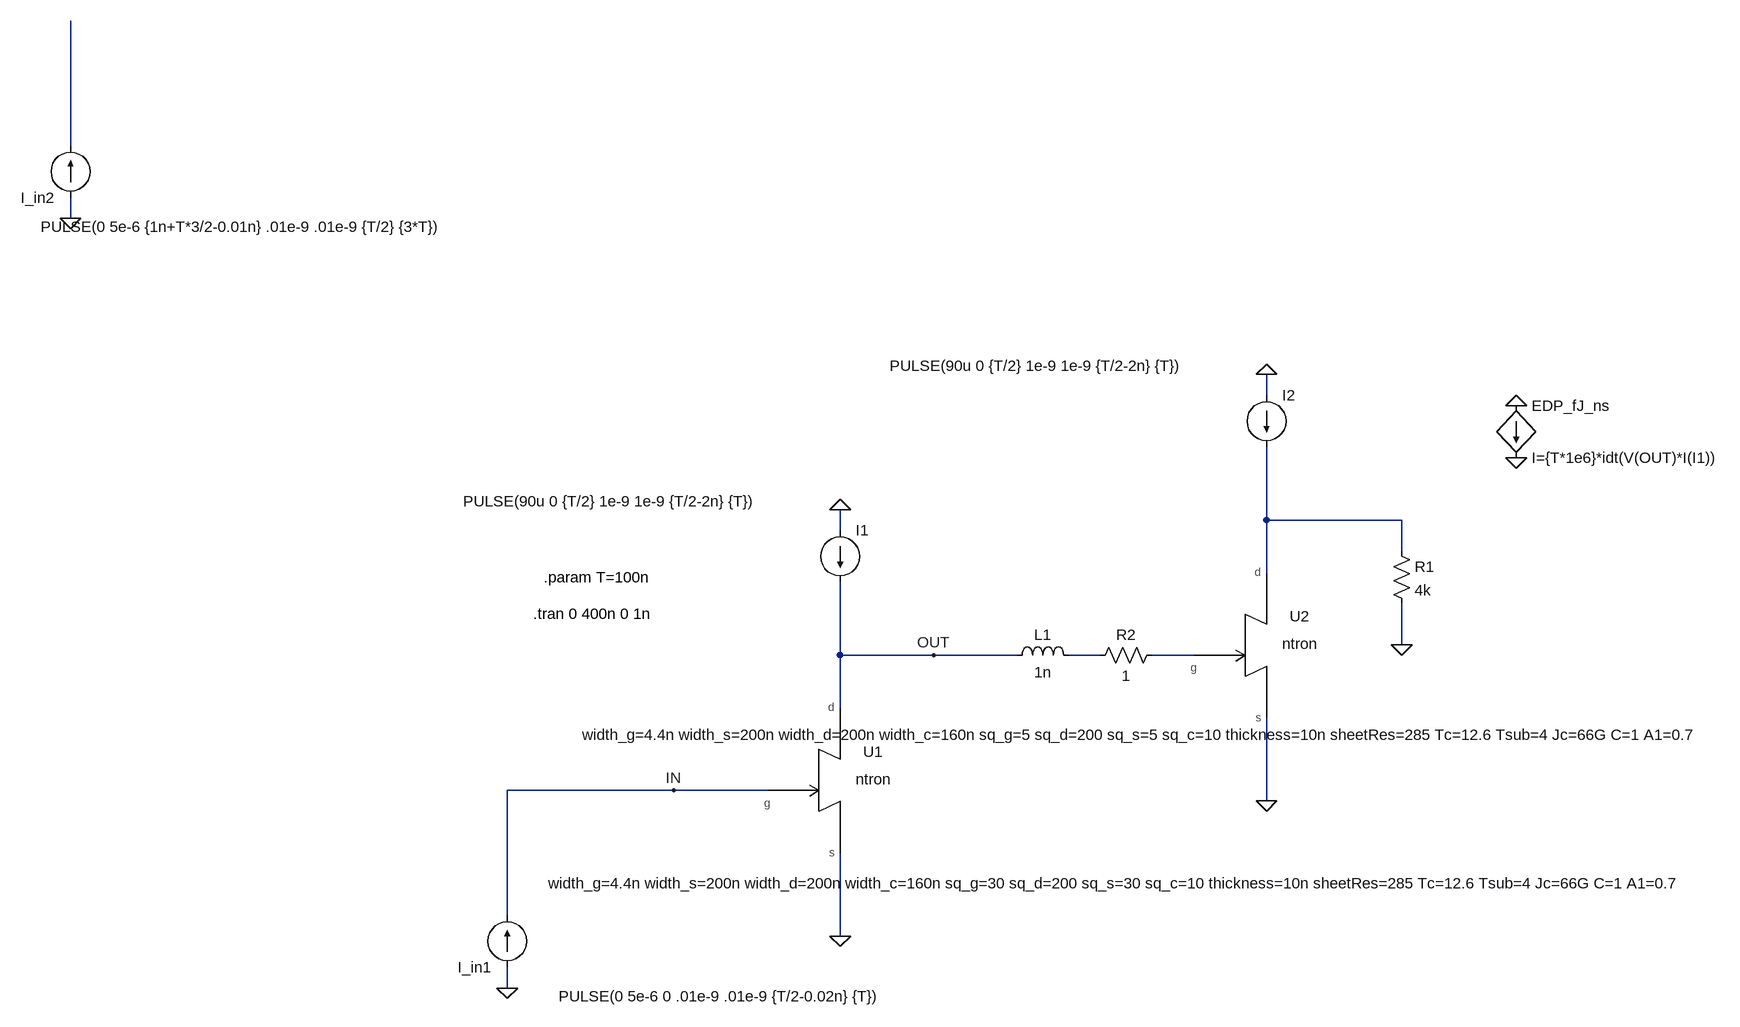
[diagram p0: schematic 2_ntron_EDP_test_latching.asc]
2_ntron_EDP_test_latching.asc, the LTspice schematic file:
Version 4
SHEET 1 1748 784
WIRE -1104 -672 -1104 -864
WIRE -1104 -560 -1104 -592
WIRE 736 -288 736 -320
WIRE 736 -96 736 -208
WIRE 944 -96 736 -96
WIRE 80 -80 80 -112
WIRE 944 -48 944 -96
WIRE 736 -16 736 -96
WIRE 944 96 944 32
WIRE 80 112 80 0
WIRE 224 112 80 112
WIRE 352 112 224 112
WIRE 480 112 432 112
WIRE 624 112 560 112
WIRE 80 192 80 112
WIRE -176 320 -432 320
WIRE -32 320 -176 320
WIRE 736 336 736 208
WIRE -432 512 -432 320
WIRE 80 544 80 416
WIRE -432 624 -432 592
FLAG 80 544 0
FLAG -432 624 0
FLAG 80 -112 0
FLAG 1120 -192 0
FLAG 1120 -272 0
FLAG -176 320 IN
FLAG 224 112 OUT
FLAG -1104 -560 0
FLAG 736 336 0
FLAG 944 96 0
FLAG 736 -320 0
SYMBOL current -432 592 R180
WINDOW 3 -580 -45 Left 2
WINDOW 123 0 0 Left 2
WINDOW 39 0 0 Left 2
SYMATTR Value PULSE(0 5e-6 0 .01e-9 .01e-9 {T/2-0.02n} {T})
SYMATTR InstName I_in1
SYMBOL bi 1120 -272 R0
SYMATTR InstName EDP_fJ_ns
SYMATTR Value I={T*1e6}*idt(V(OUT)*I(I1))
SYMBOL current -1104 -592 R180
WINDOW 3 -580 -45 Left 2
WINDOW 123 0 0 Left 2
WINDOW 39 0 0 Left 2
SYMATTR Value PULSE(0 5e-6 {1n+T*3/2-0.01n} .01e-9 .01e-9 {T/2} {3*T})
SYMATTR InstName I_in2
SYMBOL ntron 80 304 R0
WINDOW 39 433 143 Top 2
SYMATTR SpiceLine width_g=4.4n width_s=200n width_d=200n width_c=160n sq_g=30 sq_d=200 sq_s=30 sq_c=10 thickness=10n sheetRes=285 Tc=12.6 Tsub=4 Jc=66G C=1 A1=0.7
SYMATTR InstName U1
SYMBOL res 928 -64 R0
SYMATTR InstName R1
SYMATTR Value 4k
SYMBOL ntron 736 96 R0
WINDOW 39 -184 123 Top 2
SYMATTR SpiceLine width_g=4.4n width_s=200n width_d=200n width_c=160n sq_g=5 sq_d=200 sq_s=5 sq_c=10 thickness=10n sheetRes=285 Tc=12.6 Tsub=4 Jc=66G C=1 A1=0.7
SYMATTR InstName U2
SYMBOL ind 336 128 R270
WINDOW 0 32 56 VTop 2
WINDOW 3 5 56 VBottom 2
SYMATTR InstName L1
SYMATTR Value 1n
SYMBOL res 576 96 R90
WINDOW 0 0 56 VBottom 2
WINDOW 3 32 56 VTop 2
SYMATTR InstName R2
SYMATTR Value 1
SYMBOL current 80 -80 R0
WINDOW 3 -580 -45 Left 2
WINDOW 123 0 0 Left 2
WINDOW 39 0 0 Left 2
SYMATTR Value PULSE(90u 0 {T/2} 1e-9 1e-9 {T/2-2n} {T})
SYMATTR InstName I1
SYMBOL current 736 -288 R0
WINDOW 3 -580 -45 Left 2
WINDOW 123 0 0 Left 2
WINDOW 39 0 0 Left 2
SYMATTR Value PULSE(90u 0 {T/2} 1e-9 1e-9 {T/2-2n} {T})
SYMATTR InstName I2
TEXT -392 48 Left 2 !.tran 0 400n 0 1n
TEXT -376 -8 Left 2 !.param T=100n

The netlist it stands for:
* 2_ntron_EDP_test_latching.asc
I_in1 0 IN PULSE(0 5e-6 0 .01e-9 .01e-9 {T/2-0.02n} {T})
B§EDP_fJ_ns 0 0 I={T*1e6}*idt(V(OUT)*I(I1))
I_in2 0 N001 PULSE(0 5e-6 {1n+T*3/2-0.01n} .01e-9 .01e-9 {T/2} {3*T})
XU1 IN OUT 0 ntron width_g=4.4n width_s=200n width_d=200n width_c=160n sq_g=30 sq_d=200 sq_s=30 sq_c=10 thickness=10n sheetRes=285 Tc=12.6 Tsub=4 Jc=66G C=1 A1=0.7  ; pins g d s
R1 N002 0 4k
XU2 N004 N002 0 ntron width_g=4.4n width_s=200n width_d=200n width_c=160n sq_g=5 sq_d=200 sq_s=5 sq_c=10 thickness=10n sheetRes=285 Tc=12.6 Tsub=4 Jc=66G C=1 A1=0.7  ; pins g d s
L1 OUT N003 1n
R2 N004 N003 1
I1 0 OUT PULSE(90u 0 {T/2} 1e-9 1e-9 {T/2-2n} {T})
I2 0 N002 PULSE(90u 0 {T/2} 1e-9 1e-9 {T/2-2n} {T})
.tran 0 400n 0 1n
.param T=100n
.lib ntron.lib
.backanno
.end